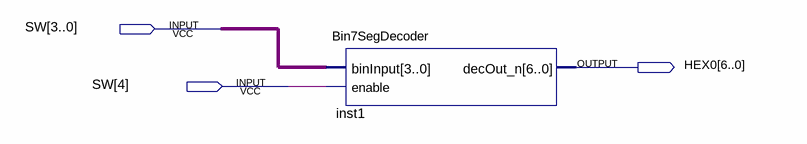
[diagram p0: schematic sheet]
// Quartus schematic DisplayDemo.bdf as structural Verilog: 1 symbols, 3 pins
module DisplayDemo (
  input  [4:0] SW,
  output [6:0] HEX0
);

  Bin7SegDecoder inst1 (.binInput(SW[3:0]), .enable(SW[4]), .decOut_n(HEX0));
endmodule
